# EAGLE schematic bbb-cc2520_b (EAGLE 6.5.0)
AUTHOR: Neal Jackson; REV: B; TITLE: Zigbeag

## Sheet 1 of 5
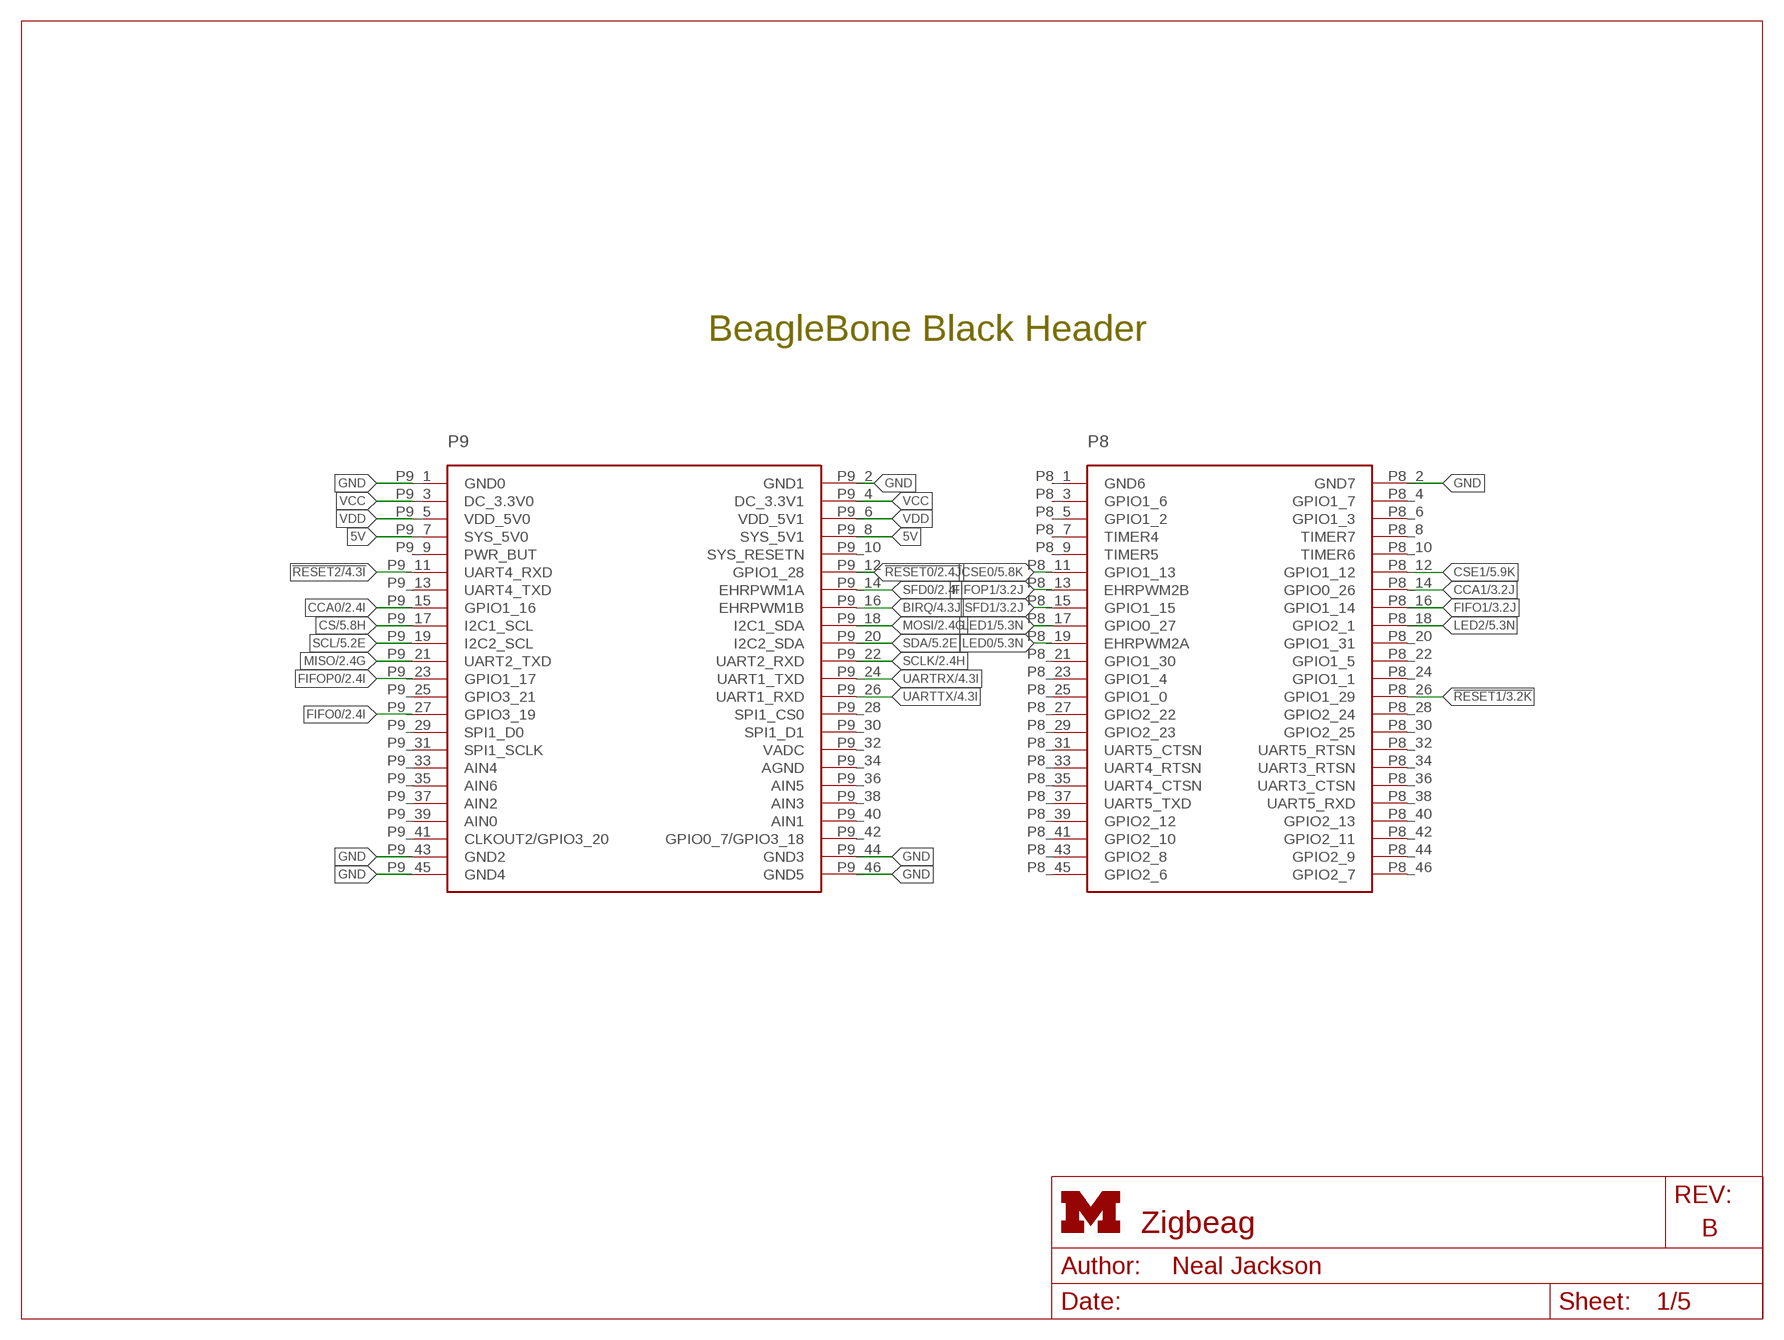
[diagram p0: schematic, sheet 1]
FRAME1 (LETTER_L): HEIGHT: 8.5in; WIDTH: 11in

### Parts
P9/P8  BBB_HEADERS  [BBB_HEADERS]

### Nets
5V: P9/P8.P9_7(SYS_5V0) P9/P8.P9_8(SYS_5V1)
!RESET0: P9/P8.P9_12(GPIO1_28) ; also sheet 2
!RESET1: P9/P8.P8_26(GPIO1_29) ; also sheet 3
!RESET2: P9/P8.P9_11(UART4_RXD) ; also sheet 4
BIRQ: P9/P8.P9_16(EHRPWM1B) ; also sheet 4
CCA0: P9/P8.P9_15(GPIO1_16) ; also sheet 2
CCA1: P9/P8.P8_14(GPIO0_26) ; also sheet 3
CS: P9/P8.P9_17(I2C1_SCL) ; also sheet 5
CSE0: P9/P8.P8_11(GPIO1_13) ; also sheet 5
CSE1: P9/P8.P8_12(GPIO1_12) ; also sheet 5
FIFO0: P9/P8.P9_27(GPIO3_19) ; also sheet 2
FIFO1: P9/P8.P8_16(GPIO1_14) ; also sheet 3
FIFOP0: P9/P8.P9_23(GPIO1_17) ; also sheet 2
FIFOP1: P9/P8.P8_13(EHRPWM2B) ; also sheet 3
GND: P9/P8.P8_2(GND7) P9/P8.P9_1(GND0) P9/P8.P9_2(GND1) P9/P8.P9_43(GND2) P9/P8.P9_44(GND3) P9/P8.P9_45(GND4) P9/P8.P9_46(GND5) ; also sheet 2,3,4,5
LED0: P9/P8.P8_19(EHRPWM2A) ; also sheet 5
LED1: P9/P8.P8_17(GPIO0_27) ; also sheet 5
LED2: P9/P8.P8_18(GPIO2_1) ; also sheet 5
MISO: P9/P8.P9_21(UART2_TXD) ; also sheet 2,3,4
MOSI: P9/P8.P9_18(I2C1_SDA) ; also sheet 2,3,4
SCL: P9/P8.P9_19(I2C2_SCL) ; also sheet 5
SCLK: P9/P8.P9_22(UART2_RXD) ; also sheet 2,3,4
SDA: P9/P8.P9_20(I2C2_SDA) ; also sheet 5
SFD0: P9/P8.P9_14(EHRPWM1A) ; also sheet 2
SFD1: P9/P8.P8_15(GPIO1_15) ; also sheet 3
UARTRX: P9/P8.P9_24(UART1_TXD) ; also sheet 4
UARTTX: P9/P8.P9_26(UART1_RXD) ; also sheet 4
VCC: P9/P8.P9_3(DC_3.3V0) P9/P8.P9_4(DC_3.3V1) ; also sheet 2,3,4,5
VDD: P9/P8.P9_5(VDD_5V0) P9/P8.P9_6(VDD_5V1)
Unconnected: P9/P8.P8_1(GND6) P9/P8.P8_3(GPIO1_6) P9/P8.P8_4(GPIO1_7) P9/P8.P8_5(GPIO1_2) P9/P8.P8_6(GPIO1_3) P9/P8.P8_7(TIMER4) P9/P8.P8_8(TIMER7) P9/P8.P8_9(TIMER5) P9/P8.P8_10(TIMER6) P9/P8.P8_20(GPIO1_31) P9/P8.P8_21(GPIO1_30) P9/P8.P8_22(GPIO1_5) P9/P8.P8_23(GPIO1_4) P9/P8.P8_24(GPIO1_1) P9/P8.P8_25(GPIO1_0) P9/P8.P8_27(GPIO2_22) P9/P8.P8_28(GPIO2_24) P9/P8.P8_29(GPIO2_23) P9/P8.P8_30(GPIO2_25) P9/P8.P8_31(UART5_CTSN) P9/P8.P8_32(UART5_RTSN) P9/P8.P8_33(UART4_RTSN) P9/P8.P8_34(UART3_RTSN) P9/P8.P8_35(UART4_CTSN) P9/P8.P8_36(UART3_CTSN) P9/P8.P8_37(UART5_TXD) P9/P8.P8_38(UART5_RXD) P9/P8.P8_39(GPIO2_12) P9/P8.P8_40(GPIO2_13) P9/P8.P8_41(GPIO2_10) P9/P8.P8_42(GPIO2_11) P9/P8.P8_43(GPIO2_8) P9/P8.P8_44(GPIO2_9) P9/P8.P8_45(GPIO2_6) P9/P8.P8_46(GPIO2_7) P9/P8.P9_9(PWR_BUT) P9/P8.P9_10(SYS_RESETN) P9/P8.P9_13(UART4_TXD) P9/P8.P9_25(GPIO3_21) P9/P8.P9_28(SPI1_CS0) P9/P8.P9_29(SPI1_D0) P9/P8.P9_30(SPI1_D1) P9/P8.P9_31(SPI1_SCLK) P9/P8.P9_32(VADC) P9/P8.P9_33(AIN4) P9/P8.P9_34(AGND) P9/P8.P9_35(AIN6) P9/P8.P9_36(AIN5) P9/P8.P9_37(AIN2) P9/P8.P9_38(AIN3) P9/P8.P9_39(AIN0) P9/P8.P9_40(AIN1) P9/P8.P9_41(CLKOUT2/GPIO3_20) P9/P8.P9_42(GPIO0_7/GPIO3_18)

### Notes on the sheet
- BeagleBone Black Header

## Sheet 2 of 5
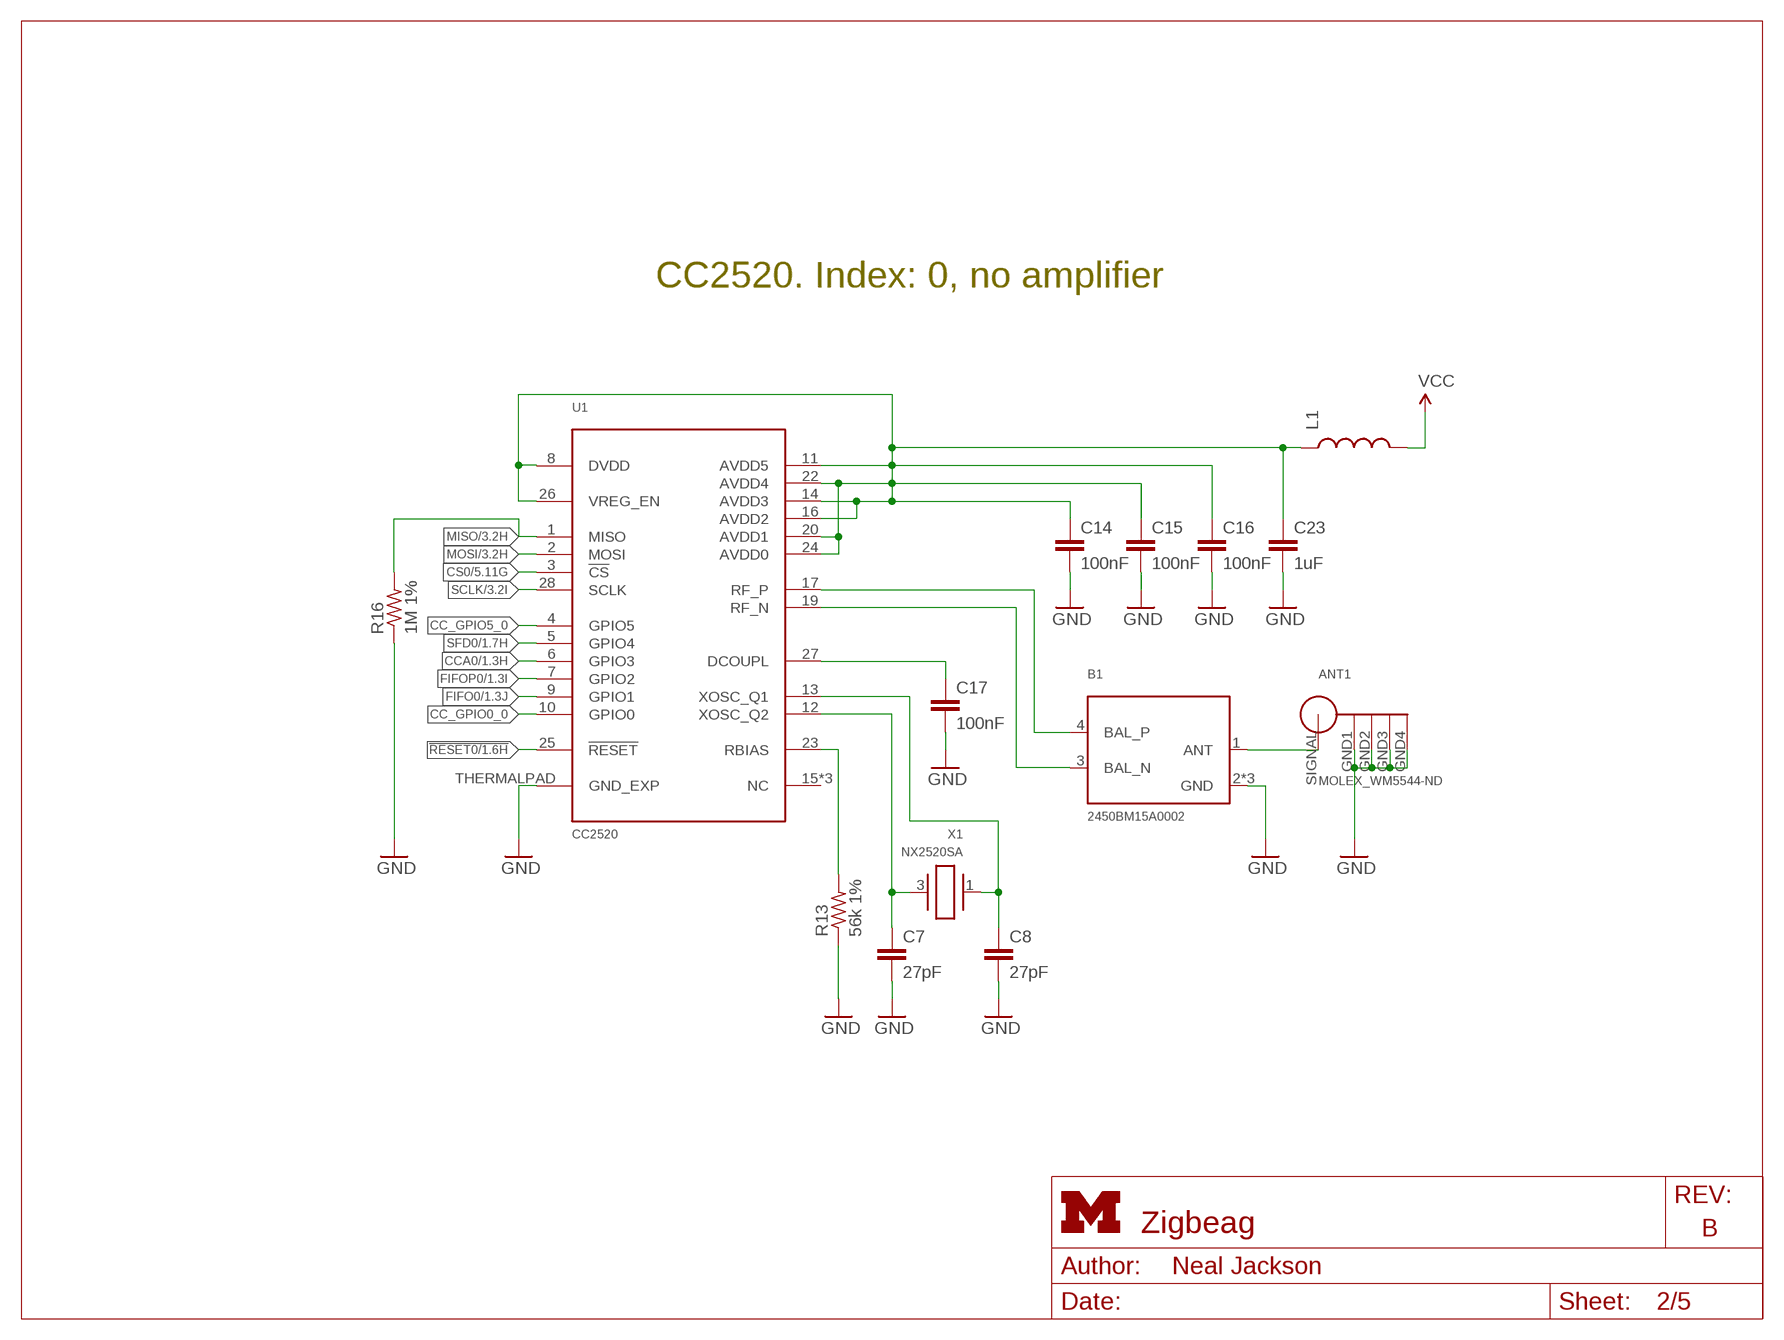
[diagram p1: schematic, sheet 2]
FRAME6 (LETTER_L): HEIGHT: 8.5in; WIDTH: 11in

### Parts
ANT1  MOLEX_WM5544-ND  [MOLEX_WM5544-ND]
B1  2450BM15A0002  [2450BM]
C7  27pF  C-EUC0402  [C0402]
C8  27pF  C-EUC0402  [C0402]
C14  100nF  C-EUC0402  [C0402]
C15  100nF  C-EUC0402  [C0402]
C16  100nF  C-EUC0402  [C0402]
C17  100nF  C-EUC0402  [C0402]
C23  1uF  C-EUC0603  [C0603]
L1  INDUCTOR0603  [0603]
R13  56k 1%  R-US_R0402  [R0402]
R16  1M 1%  R-US_R0402  [R0402]
U1  CC2520  [S-PVQFN-N28]
X1  NX2520SA  [NX2520SA]

### Nets
!RESET0: U1.25(!RESET) ; also sheet 1
CC_GPIO0_0: U1.10(GPIO0)
CC_GPIO5_0: U1.4(GPIO5)
CCA0: U1.6(GPIO3) ; also sheet 1
CS0: U1.3(!CS) ; also sheet 5
FIFO0: U1.9(GPIO1) ; also sheet 1
FIFOP0: U1.7(GPIO2) ; also sheet 1
GND: ANT1.GND1 ANT1.GND2 ANT1.GND3 ANT1.GND4 B1.2(GND) B1.5(GND) B1.6(GND) C7.2 C8.2 C14.2 C15.2 C16.2 C17.2 C23.2 R13.1 R16.1 U1.THERMALPAD(GND_EXP) ; also sheet 1,3,4,5
MISO: R16.2 U1.1(MISO) ; also sheet 1,3,4
MOSI: U1.2(MOSI) ; also sheet 1,3,4
N$5: C14.1 C15.1 C16.1 C23.1 L1.1 U1.8(DVDD) U1.11(AVDD5) U1.14(AVDD3) U1.16(AVDD2) U1.20(AVDD1) U1.22(AVDD4) U1.24(AVDD0) U1.26(VREG_EN)
N$7: ANT1.SIGNAL B1.1(ANT)
N$11: C8.1 U1.13(XOSC_Q1) X1.1
N$12: C17.1 U1.27(DCOUPL)
N$13: C7.1 U1.12(XOSC_Q2) X1.3
N$14: R13.2 U1.23(RBIAS)
RF_N: B1.3(BAL_N) U1.19(RF_N)
RF_P: B1.4(BAL_P) U1.17(RF_P)
SCLK: U1.28(SCLK) ; also sheet 1,3,4
SFD0: U1.5(GPIO4) ; also sheet 1
VCC: L1.2 ; also sheet 1,3,4,5
Unconnected: U1.15(NC) U1.18(NC) U1.21(NC)

### Notes on the sheet
- CC2520. Index: 0, no amplifier

## Sheet 3 of 5
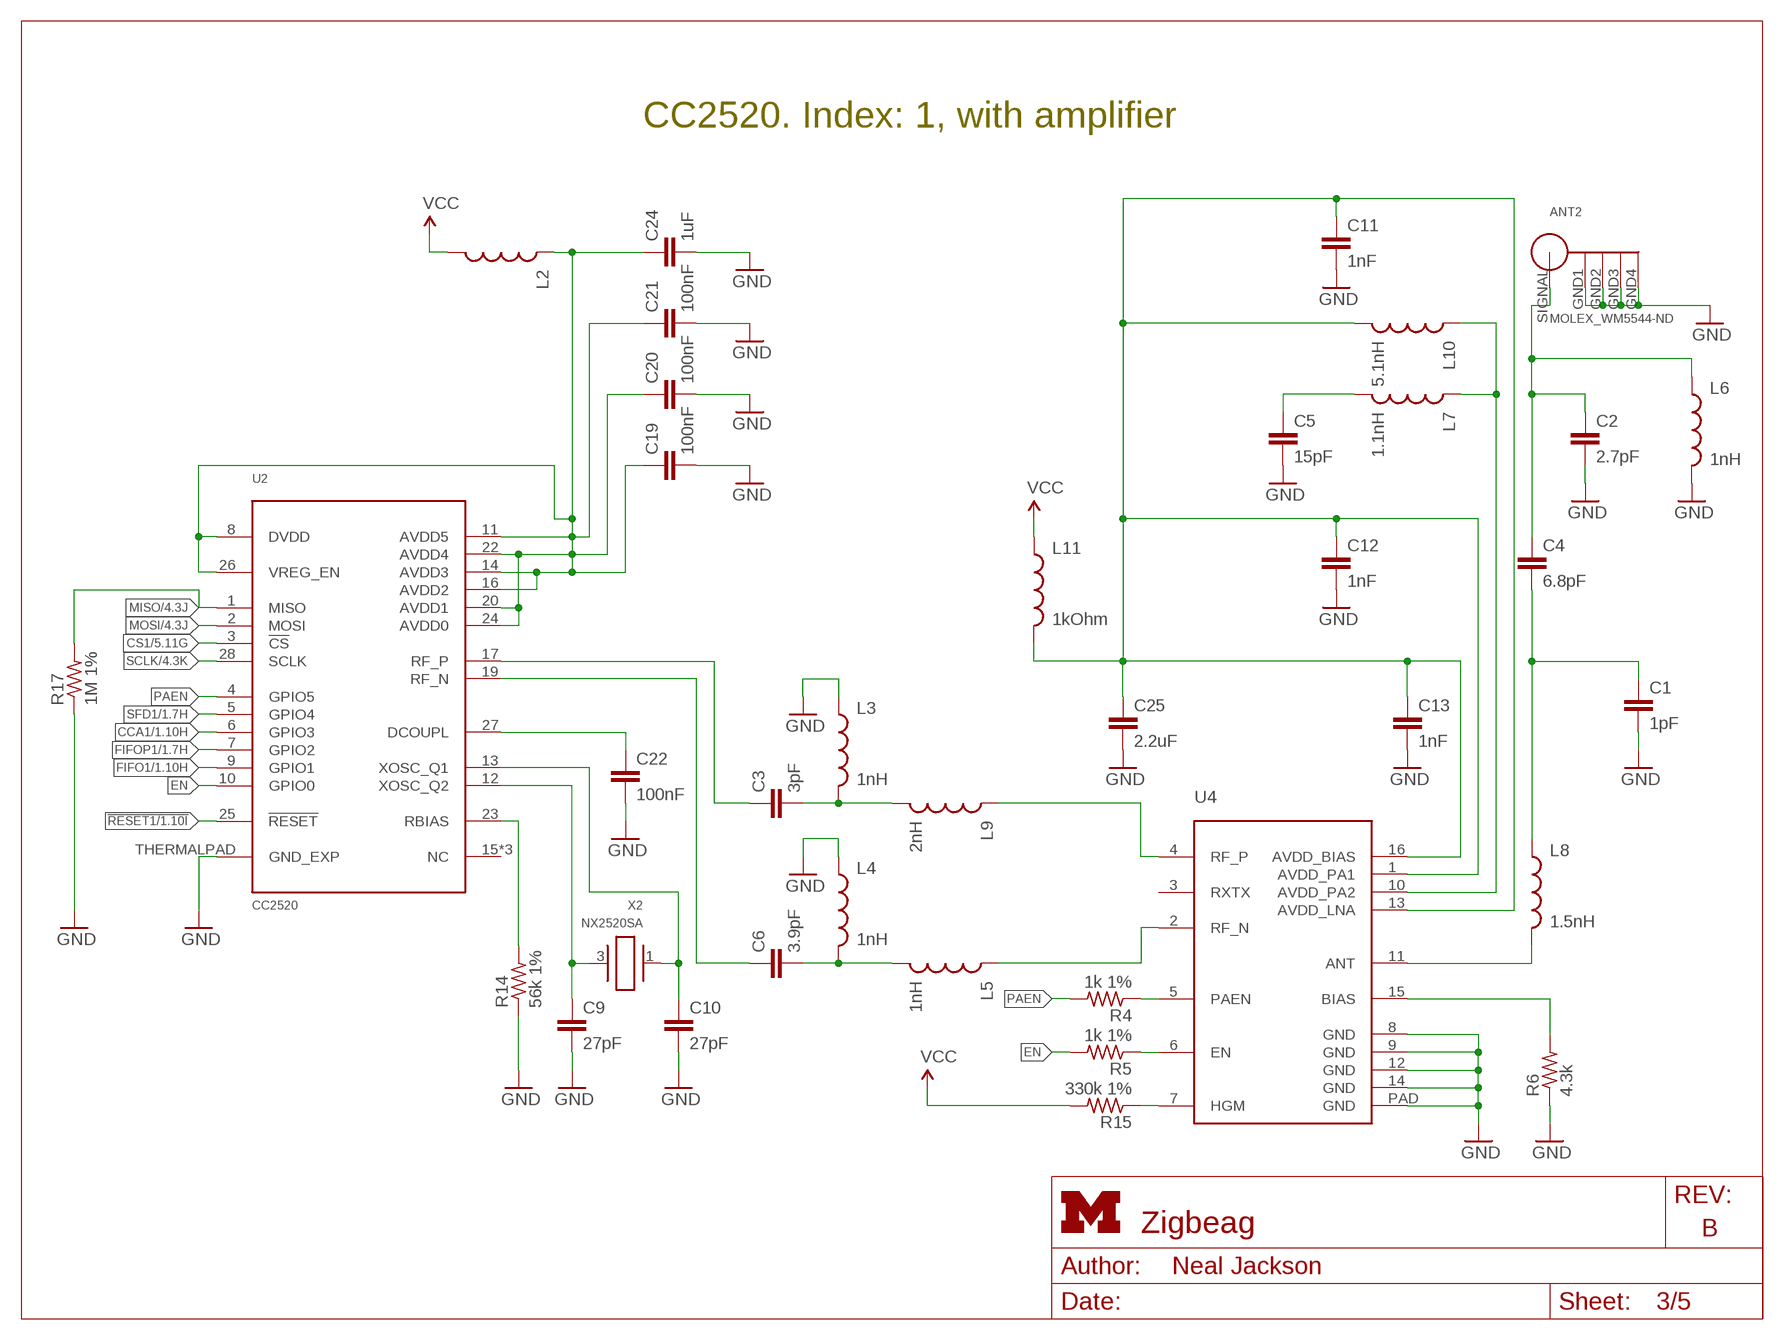
[diagram p2: schematic, sheet 3]
FRAME3 (LETTER_L): HEIGHT: 8.5in; WIDTH: 11in

### Parts
ANT2  MOLEX_WM5544-ND  [MOLEX_WM5544-ND]
C1  1pF  C-EUC0402  [C0402]
C2  2.7pF  C-EUC0402  [C0402]
C3  3pF  C-EUC0402  [C0402]
C4  6.8pF  C-EUC0402  [C0402]
C5  15pF  C-EUC0402  [C0402]
C6  3.9pF  C-EUC0402  [C0402]
C9  27pF  C-EUC0402  [C0402]
C10  27pF  C-EUC0402  [C0402]
C11  1nF  C-EUC0402  [C0402]
C12  1nF  C-EUC0402  [C0402]
C13  1nF  C-EUC0402  [C0402]
C19  100nF  C-EUC0402  [C0402]
C20  100nF  C-EUC0402  [C0402]
C21  100nF  C-EUC0402  [C0402]
C22  100nF  C-EUC0402  [C0402]
C24  1uF  C-EUC0603  [C0603]
C25  2.2uF  C-EUC0402  [C0402]
L2  INDUCTOR0603  [0603]
L3  1nH  INDUCTOR0402  [C0402]
L4  1nH  INDUCTOR0402  [C0402]
L5  1nH  INDUCTOR0402  [C0402]
L6  1nH  INDUCTOR0402  [C0402]
L7  1.1nH  INDUCTOR0402  [C0402]
L8  1.5nH  INDUCTOR0402  [C0402]
L9  2nH  INDUCTOR0402  [C0402]
L10  5.1nH  INDUCTOR0402  [C0402]
L11  1kOhm  INDUCTOR0402  [C0402]
R4  1k 1%  R-US_R0402  [R0402]
R5  1k 1%  R-US_R0402  [R0402]
R6  4.3k  R-US_R0402  [R0402]
R14  56k 1%  R-US_R0402  [R0402]
R15  330k 1%  R-US_R0402  [R0402]
R17  1M 1%  R-US_R0402  [R0402]
U2  CC2520  [S-PVQFN-N28]
U4  CC2591  [PVQFN-16]
X2  NX2520SA  [NX2520SA]

### Nets
!RESET1: U2.25(!RESET) ; also sheet 1
CCA1: U2.6(GPIO3) ; also sheet 1
CS1: U2.3(!CS) ; also sheet 5
EN: R5.2 U2.10(GPIO0)
FIFO1: U2.9(GPIO1) ; also sheet 1
FIFOP1: U2.7(GPIO2) ; also sheet 1
GND: ANT2.GND1 ANT2.GND2 ANT2.GND3 ANT2.GND4 C1.2 C2.2 C5.2 C9.2 C10.2 C11.2 C12.2 C13.2 C19.2 C20.2 C21.2 C22.2 C24.2 C25.2 L3.1 L4.1 L6.2 R6.1 R14.1 R17.1 U2.THERMALPAD(GND_EXP) U4.8(GND) U4.9(GND) U4.12(GND) U4.14(GND) U4.PAD(GND) ; also sheet 1,2,4,5
MISO: R17.2 U2.1(MISO) ; also sheet 1,2,4
MOSI: U2.2(MOSI) ; also sheet 1,2,4
N$44: L9.1 U4.4(RF_P)
N$45: L5.1 U4.2(RF_N)
N$46: C6.2 L4.2 L5.2
N$47: C3.2 L3.2 L9.2
N$48: L7.1 L10.1 U4.10(AVDD_PA2)
N$49: C11.1 C12.1 C13.1 C25.1 L10.2 L11.2 U4.1(AVDD_PA1) U4.13(AVDD_LNA) U4.16(AVDD_BIAS)
N$50: C5.1 L7.2
N$51: L8.2 U4.11(ANT)
N$52: ANT2.SIGNAL C2.1 C4.1 L6.1
N$53: C1.1 C4.2 L8.1
N$54: R6.2 U4.15(BIAS)
N$55: R4.1 U4.5(PAEN)
N$56: R5.1 U4.6(EN)
N$57: C19.1 C20.1 C21.1 C24.1 L2.1 U2.8(DVDD) U2.11(AVDD5) U2.14(AVDD3) U2.16(AVDD2) U2.20(AVDD1) U2.22(AVDD4) U2.24(AVDD0) U2.26(VREG_EN)
N$58: C22.1 U2.27(DCOUPL)
N$59: C10.1 U2.13(XOSC_Q1) X2.1
N$60: C9.1 U2.12(XOSC_Q2) X2.3
N$61: R14.2 U2.23(RBIAS)
N$62: R15.1 U4.7(HGM)
PAEN: R4.2 U2.4(GPIO5)
RF_N2: C6.1 U2.19(RF_N)
RF_P2: C3.1 U2.17(RF_P)
SCLK: U2.28(SCLK) ; also sheet 1,2,4
SFD1: U2.5(GPIO4) ; also sheet 1
VCC: L2.2 L11.1 R15.2 ; also sheet 1,2,4,5
Unconnected: U2.15(NC) U2.18(NC) U2.21(NC) U4.3(RXTX)

### Notes on the sheet
- CC2520. Index: 1, with amplifier

## Sheet 4 of 5
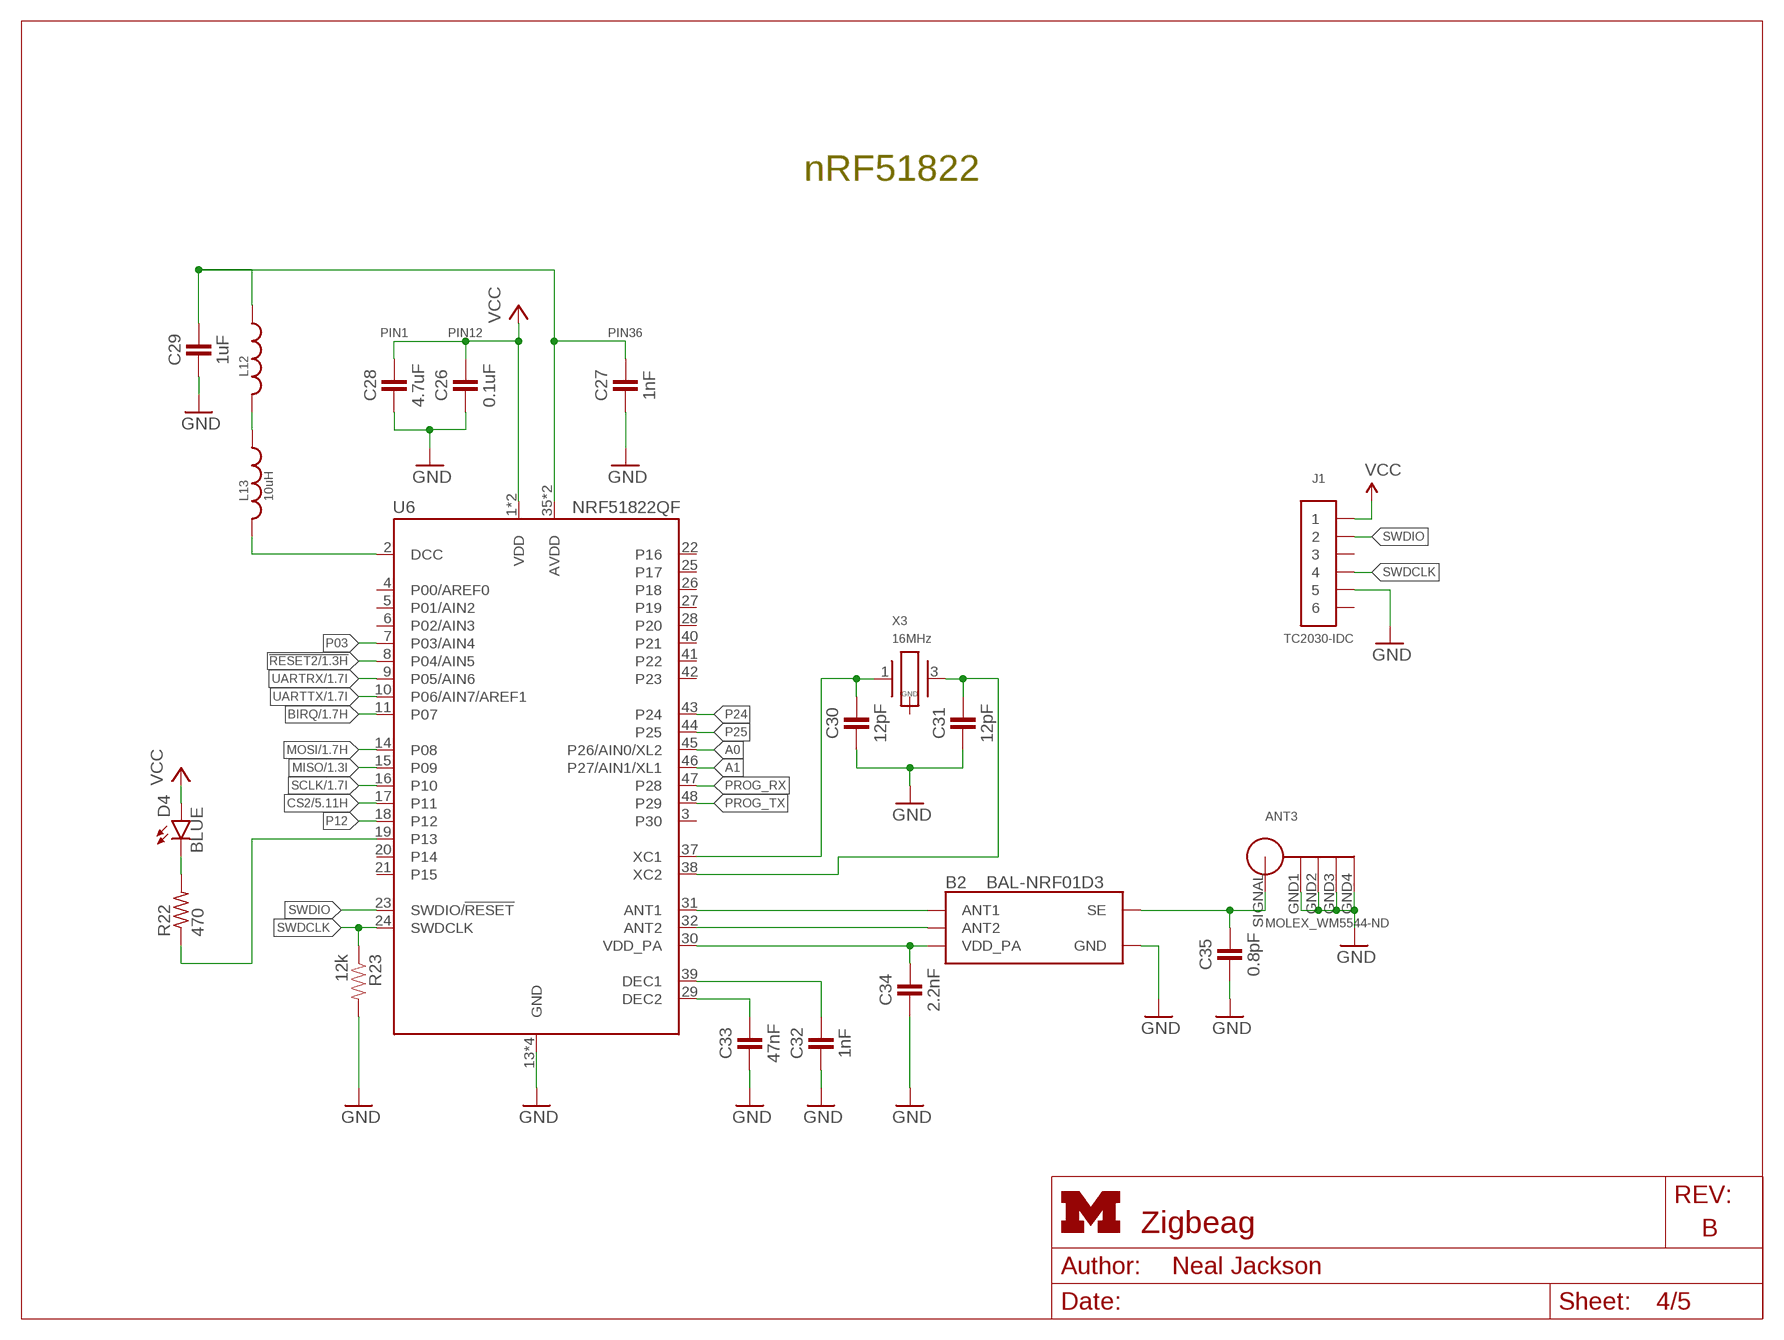
[diagram p3: schematic, sheet 4]
FRAME2 (LETTER_L): HEIGHT: 8.5in; WIDTH: 11in

### Parts
ANT3  MOLEX_WM5544-ND  [MOLEX_WM5544-ND]
B2  BAL-NRF01D3  [BAL-NRF01D3]
C26  0.1uF  CAPACITOR  [0402_CAP]
C27  1nF  CAPACITOR  [0402_CAP]
C28  4.7uF  CAPACITOR  [0402_CAP]
C29  1uF  CAPACITOR  [0402_CAP]
C30  12pF  CAPACITOR  [0402_CAP]
C31  12pF  CAPACITOR  [0402_CAP]
C32  1nF  CAPACITOR  [0402_CAP]
C33  47nF  CAPACITOR  [0402_CAP]
C34  2.2nF  CAPACITOR  [0402_CAP]
C35  0.8pF  CAPACITOR  [0402_CAP]
D4  BLUE  LED0603  [LED-0603]
J1  TC2030-IDC  [TC2030-IDC]
L12  INDUCTOR0402  [0402_CAP]
L13  10uH  INDUCTOR0603  [0603_CAP]
R22  470  R-US_R0402  [R0402]
R23  12k  RESISTOR  [0603-RES]
U6  NRF51822QF  [QFN-48-6MM]
X3  16MHz  TXC-8Y  [TXC-8Y]

### Nets
!RESET2: U6.8(P04/AIN5) ; also sheet 1
A0: U6.45(P26/AIN0/XL2)
A1: U6.46(P27/AIN1/XL1)
AVDD: C27.1 C29.1 L12.1 U6.35(AVDD) U6.36(AVDD)
BIRQ: U6.11(P07) ; also sheet 1
CS2: U6.17(P11) ; also sheet 5
DCC: L13.2 U6.2(DCC)
GND: ANT3.GND1 ANT3.GND2 ANT3.GND3 ANT3.GND4 B2.GND C26.2 C27.2 C28.2 C29.2 C30.2 C31.2 C32.2 C33.2 C34.2 C35.2 J1.5 R23.2 U6.13(GND) U6.33(GND) U6.34(GND) U6.GND ; also sheet 1,2,3,5
MISO: U6.15(P09) ; also sheet 1,2,3
MOSI: U6.14(P08) ; also sheet 1,2,3
N$36: B2.ANT1 U6.31(ANT1)
N$37: B2.ANT2 U6.32(ANT2)
N$38: ANT3.SIGNAL B2.SE C35.1
N$39: L12.2 L13.1
N$40: C30.1 U6.37(XC1) X3.1
N$41: C31.1 U6.38(XC2) X3.3
N$42: C32.1 U6.39(DEC1)
N$43: C33.1 U6.29(DEC2)
N$63: D4.C R22.2
N$64: R22.1 U6.19(P13)
P03: U6.7(P03/AIN4)
P12: U6.18(P12)
P24: U6.43(P24)
P25: U6.44(P25)
PROG_RX: U6.47(P28)
PROG_TX: U6.48(P29)
SCLK: U6.16(P10) ; also sheet 1,2,3
SWDCLK: J1.4 R23.1 U6.24(SWDCLK)
SWDIO: J1.2 U6.23(SWDIO/!RESET)
UARTRX: U6.9(P05/AIN6) ; also sheet 1
UARTTX: U6.10(P06/AIN7/AREF1) ; also sheet 1
VCC: C26.1 C28.1 D4.A J1.1 U6.1(VDD) U6.12(VDD) ; also sheet 1,2,3,5
VDD_PA: B2.VCC(VDD_PA) C34.1 U6.30(VDD_PA)
Unconnected: J1.3 J1.6 U6.3(P30) U6.4(P00/AREF0) U6.5(P01/AIN2) U6.6(P02/AIN3) U6.20(P14) U6.21(P15) U6.22(P16) U6.25(P17) U6.26(P18) U6.27(P19) U6.28(P20) U6.40(P21) U6.41(P22) U6.42(P23) X3.2(GND) X3.4(GND)

### Notes on the sheet
- nRF51822
- PIN1 | PIN12 | PIN36

## Sheet 5 of 5
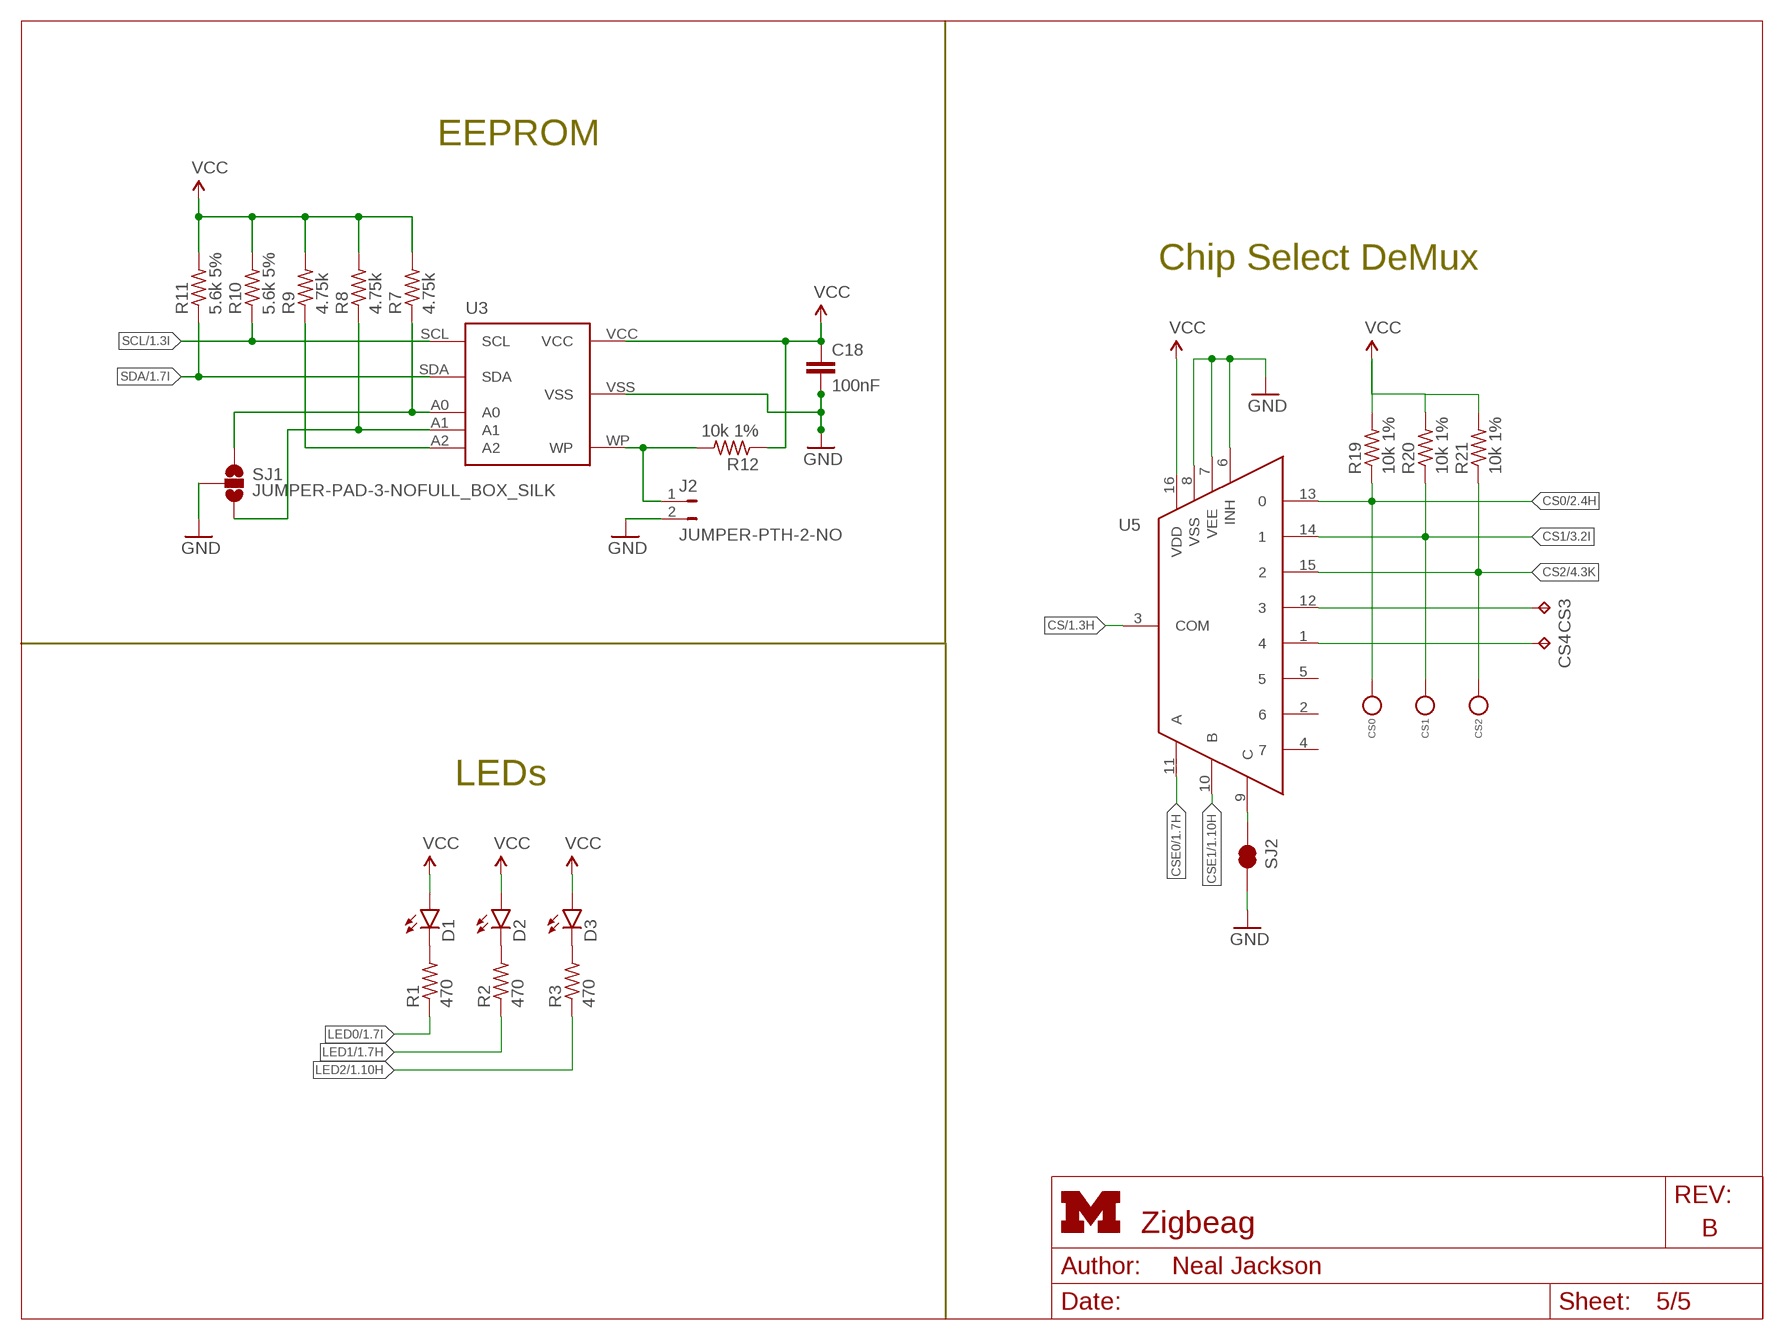
[diagram p4: schematic, sheet 5]
FRAME4 (LETTER_L): HEIGHT: 8.5in; WIDTH: 11in

### Parts
C18  100nF  C-EUC0402  [C0402]
CS0  TEST_POINT_0.040IN  [TESTPOINT_0.040IN]
CS1  TEST_POINT_0.040IN  [TESTPOINT_0.040IN]
CS2  TEST_POINT_0.040IN  [TESTPOINT_0.040IN]
CS3  TPTP14SQ  [TP14SQ]
CS4  TPTP14SQ  [TP14SQ]
D1  LED0603  [LED-0603]
D2  LED0603  [LED-0603]
D3  LED0603  [LED-0603]
J2  JUMPER-PTH-2-NO  [PTH-JUMPER-2-NO_NO_SILK]
R1  470  R-US_R0402  [R0402]
R2  470  R-US_R0402  [R0402]
R3  470  R-US_R0402  [R0402]
R7  4.75k  R-US_R0402  [R0402]
R8  4.75k  R-US_R0402  [R0402]
R9  4.75k  R-US_R0402  [R0402]
R10  5.6k 5%  R-US_R0402  [R0402]
R11  5.6k 5%  R-US_R0402  [R0402]
R12  10k 1%  R-US_R0402  [R0402]
R19  10k 1%  R-US_R0402  [R0402]
R20  10k 1%  R-US_R0402  [R0402]
R21  10k 1%  R-US_R0402  [R0402]
SJ1  JUMPER-PAD-3-NOFULL_BOX_SILK  [PAD-JUMPER-3-NO_YES_SILK_FULL_BOX]
SJ2  JUMPER-PAD-2-NC_BY_TRACE  [PAD-JUMPER-2-NC_BY_TRACE_YES_SILK]
U3  CAT24C256WI-GT3  [CAT24C256WI-GT3]
U5  CD4051B-53B  [TSSOP16]

### Nets
CS: U5.3(COM) ; also sheet 1
CS0: CS0.TESTPOINT R19.1 U5.13 ; also sheet 2
CS1: CS1.TESTPOINT R20.1 U5.14 ; also sheet 3
CS2: CS2.TESTPOINT R21.1 U5.15 ; also sheet 4
CSE0: U5.11(A) ; also sheet 1
CSE1: U5.10(B) ; also sheet 1
GND: C18.2 J2.2 SJ1.2 SJ2.2 U3.VSS U5.6(INH) U5.7(VEE) U5.8(VSS) ; also sheet 1,2,3,4
LED0: R1.1 ; also sheet 1
LED1: R2.1 ; also sheet 1
LED2: R3.1 ; also sheet 1
N$1: D1.C R1.2
N$2: D2.C R2.2
N$3: D3.C R3.2
N$29: R7.1 SJ1.1 U3.A0
N$30: R8.1 SJ1.3 U3.A1
N$31: J2.1 R12.2 U3.WP
N$32: R9.1 U3.A2
N$65: SJ2.1 U5.9(C)
N$66: CS3.TP U5.12
N$67: CS4.TP U5.1
SCL: R10.1 U3.SCL ; also sheet 1
SDA: R11.1 U3.SDA ; also sheet 1
VCC: C18.1 D1.A D2.A D3.A R7.2 R8.2 R9.2 R10.2 R11.2 R12.1 R19.2 R20.2 R21.2 U3.VCC U5.16(VDD) ; also sheet 1,2,3,4
Unconnected: U5.2 U5.4 U5.5

### Notes on the sheet
- EEPROM
- Chip Select DeMux
- LEDs

## Library data of the parts
ANT1-ANT3 = connector:MOLEX_WM5544-ND: Through-hole SMA Antenna; DIGIKEY: WM5544-ND
B1 = rpi-cc2520:2450BM15A0002: BALUN JTI MATCHED ZIGBEE; DIGIKEY: 712-1536-1-ND
B2 = chips:BAL-NRF01D3: 50 ohm nominal input / conjugate match balun to nRF51422-QFAA, nRF24LE1, nRF51822-QFAA/AB, with integrated harmonic filter; DIGIKEY: 497-13637-1-ND; MOUSER: 511-BAL-NRF01D3
C1-C6 C11-C22 C25 = rcl:C-EU: CAPACITOR, European symbol; DIGIKEY: 490-1318-1-ND
C7-C10 = rcl:C-EU: CAPACITOR, European symbol; DIGIKEY: 490-5869-1-ND
C23 C24 = rcl:C-EU: CAPACITOR, European symbol; DIGIKEY: 490-1550-1-ND
C26 = passives:CAPACITOR: 0402 Capacitor; DIGIKEY: 445-4952-1-ND
C27 C32 = passives:CAPACITOR: 0402 Capacitor; DIGIKEY: 490-1303-1-ND
C28 = passives:CAPACITOR: 0402 Capacitor; DIGIKEY: 445-5947-1-ND
C29 = passives:CAPACITOR: 0402 Capacitor; DIGIKEY: 1276-1513-1-ND
C30 C31 = passives:CAPACITOR: 0402 Capacitor; DIGIKEY: 490-6197-1-ND
C33 = passives:CAPACITOR: 0402 Capacitor; DIGIKEY: 445-1264-1-ND
C34 C35 = passives:CAPACITOR: 0402 Capacitor; DIGIKEY: 490-5419-1-ND
CS0 CS1 CS2 = headers:TEST_POINT_0.040IN: 0.040in Test Point; DIGIKEY: 5001K-ND
CS3 CS4 = testpad:TP: Test pad
D1 = SparkFun-LED:LED: LEDs Standard schematic elements and footprints for 5mm, 3mm, 1206, and 0603 sized LEDs. 5mm - Spark Fun Electronics SKU : COM-00529 (and others); DIGIKEY: 160-1834-1-ND
D2 = SparkFun-LED:LED: LEDs Standard schematic elements and footprints for 5mm, 3mm, 1206, and 0603 sized LEDs. 5mm - Spark Fun Electronics SKU : COM-00529 (and others); DIGIKEY: 160-1835-1-ND
D3 = SparkFun-LED:LED: LEDs Standard schematic elements and footprints for 5mm, 3mm, 1206, and 0603 sized LEDs. 5mm - Spark Fun Electronics SKU : COM-00529 (and others); DIGIKEY: 160-1837-1-ND
D4 = SparkFun-LED:LED: LEDs Standard schematic elements and footprints for 5mm, 3mm, 1206, and 0603 sized LEDs. 5mm - Spark Fun Electronics SKU : COM-00529 (and others)
J1 = connector:TC2030-IDC: The TC2030-IDC is our "Legged" 6-pin Plug-of-Nailstm Cable fitted with a 6-pin 0.1" pitch ribbon connector.; TAGCONNECT: TC2030-IDC
J2 = SparkFun-Passives:JUMPER-PTH-2-NO
L1 L2 = SparkFun-Passives:INDUCTOR: Inductors Basic Inductor/Choke - 0603 and 1206. Footprints are not proven and vary greatly between part numbers. SRN6045- 33uH, 20% 1.4A SDR0403-560KL - 56uH, 10%, 500mA RMS/740mA peak; DIGIKEY: 490-1015-1-ND
L3-L11 = SparkFun-Passives:INDUCTOR: Inductors Basic Inductor/Choke - 0603 and 1206. Footprints are not proven and vary greatly between part numbers. SRN6045- 33uH, 20% 1.4A SDR0403-560KL - 56uH, 10%, 500mA RMS/740mA peak
L12 = passives:INDUCTOR; DIGIKEY: 587-1521-1-ND
L13 = passives:INDUCTOR; DIGIKEY: 490-4025-1-ND
P9/P8 = bbb-cc2520:BBB_HEADERS: Pin Header 2x23
R1-R3 R22 = rcl:R-US_: RESISTOR, American symbol; DIGIKEY: RHM470JCT-ND
R4-R6 R13-R15 = rcl:R-US_: RESISTOR, American symbol; DIGIKEY: P56.0KLCT-ND
R7-R12 R16 R17 R19-R21 = rcl:R-US_: RESISTOR, American symbol; DIGIKEY: RHM1.00MCDCT-ND
R23 = passives:RESISTOR: Resistor Basic schematic elements and footprints for 0603, 1206, and PTH resistors.; DIGIKEY: RHM12.0KCDCT-ND
SJ1 = SparkFun-Passives:JUMPER-PAD-3-NO
SJ2 = SparkFun-Passives:JUMPER-PAD-2-NC_BY_TRACE
U1 U2 = chips:CC2520: 2.4 GHZ IEEE 802.15.4/ZIGBEE® RF TRANSCEIVER; DIGIKEY: 296-22996-1-ND
U3 = bbb-cc2520:CAT24C256: 256kb Serial CMOS EEPROM, organized as 32,768 words of 8 bits each
U4 = bbb-cc2520:CC2591
U5 = bbb-cc2520:CD4051B-53B: IC MUX/DEMUX 8x1 16TSSOP; DIGIKEY: 296-11993-1-ND
U6 = chips:NRF51822: Multiprotocol Bluetooth® 4.0 low energy/2.4 GHz RF SoC; DIGIKEY: 1490-1032-1-ND; MOUSER: 949-NRF51822-QFAB-R7
X1 X2 = rpi-cc2520:NX2520SA: CRYSTAL 32MHZ 10PF SMD; DIGIKEY: 644-1065-1-ND
X3 = crystals:TXC-8Y: 2mmx1.6mm SMD Crystal; DIGIKEY: 887-2003-1-ND